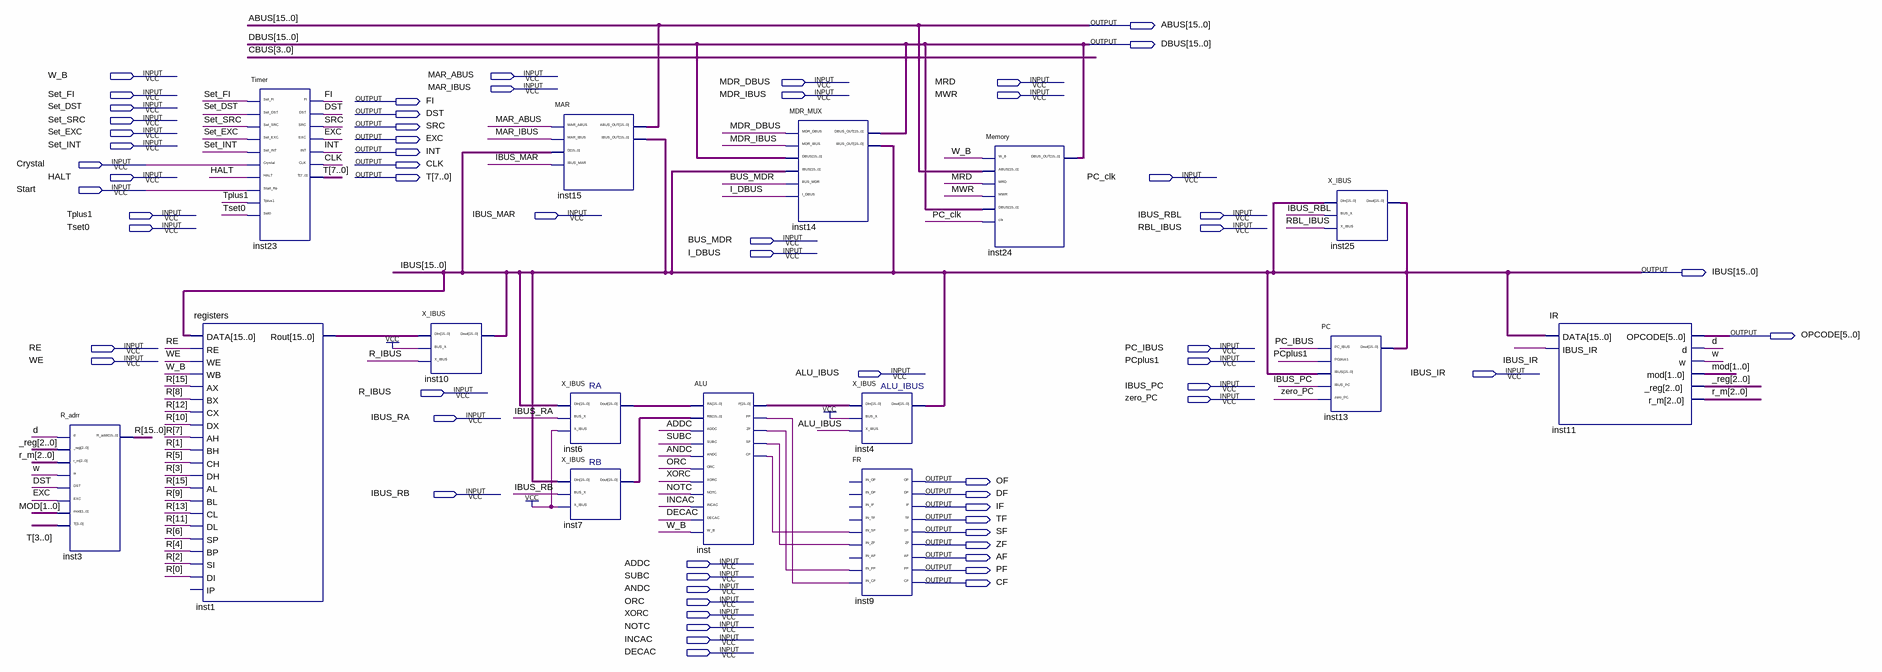
[diagram p0: schematic sheet]
// Quartus schematic CPU_test_withoutCU.bdf as structural Verilog: 15 symbols, 62 pins
module CPU_test_withoutCU (
  input  W_B,
  input  MAR_ABUS,
  input  MDR_DBUS,
  input  MRD,
  input  MAR_IBUS,
  input  Set_FI,
  input  MDR_IBUS,
  input  MWR,
  input  Set_DST,
  input  Set_SRC,
  input  Set_EXC,
  input  Set_INT,
  input  Crystal,
  input  HALT,
  input  PC_clk,
  input  Start,
  input  Tplus1,
  input  IBUS_MAR,
  input  IBUS_RBL,
  input  Tset0,
  input  RBL_IBUS,
  input  BUS_MDR,
  input  I_DBUS,
  input  RE,
  input  PC_IBUS,
  input  WE,
  input  PCplus1,
  input  ALU_IBUS,
  input  IBUS_IR,
  input  IBUS_PC,
  input  R_IBUS,
  input  zero_PC,
  input  IBUS_RA,
  input  IBUS_RB,
  input  ADDC,
  input  SUBC,
  input  ANDC,
  input  ORC,
  input  XORC,
  input  NOTC,
  input  INCAC,
  input  DECAC,
  output [15:0] ABUS,
  output [15:0] DBUS,
  output FI,
  output DST,
  output SRC,
  output EXC,
  output INT,
  output CLK,
  output [7:0] T,
  output [15:0] IBUS,
  output [5:0] OPCODE,
  output OF,
  output DF,
  output IF,
  output TF,
  output SF,
  output ZF,
  output AF,
  output PF,
  output CF
);

  wire d, inst_cf, inst_pf, inst_sf, inst_zf, w;
  wire [1:0] mod;
  wire [2:0] _reg, r_m;
  wire [15:0] inst1_rout, inst6_dout, inst7_dout, inst_f, R;

  R_adrr inst3 (.d(d), ._reg(_reg), .r_m(r_m), .w(w), .DST(DST), .EXC(EXC), .mod(mod), .T(T[3:0]), .R_addr(R));
  registers inst1 (
    .DATA(IBUS), .RE(RE), .WE(WE), .WB(W_B), .AX(R[15]), .BX(R[8]), .CX(R[12]), .DX(R[10]), .AH(R[7]),
    .BH(R[1]), .CH(R[5]), .DH(R[3]), .AL(R[15]), .BL(R[9]), .CL(R[13]), .DL(R[11]), .SP(R[6]), .BP(R[4]),
    .SI(R[2]), .DI(R[0]), .Rout(inst1_rout));  // open: IP
  Timer inst23 (
    .Set_Fi(Set_FI), .Set_DST(Set_DST), .Set_SRC(Set_SRC), .Set_EXC(Set_EXC), .Set_INT(Set_INT),
    .Crystal(Crystal), .HALT(HALT), .Start_Re(Start), .Tplus1(Tplus1), .Set0(Tset0), .FI(FI), .DST(DST),
    .SRC(SRC), .EXC(EXC), .INT(INT), .CLK(CLK), .T(T));
  X_IBUS inst10 (.DIn(inst1_rout), .BUS_X(1'b1), .X_IBUS(R_IBUS), .Dout(IBUS));
  MAR inst15 (
    .MAR_ABUS(MAR_ABUS), .MAR_IBUS(MAR_IBUS), .D(IBUS), .IBUS_MAR(IBUS_MAR), .ABUS_OUT(ABUS), .IBUS_OUT(IBUS));
  X_IBUS inst6 (.DIn(IBUS), .BUS_X(IBUS_RA), .X_IBUS(1'b1), .Dout(inst6_dout));
  X_IBUS inst7 (.DIn(IBUS), .BUS_X(IBUS_RB), .X_IBUS(1'b1), .Dout(inst7_dout));
  ALU inst (
    .RA(inst6_dout), .RB(inst7_dout), .ADDC(ADDC), .SUBC(SUBC), .ANDC(ANDC), .ORC(ORC), .XORC(XORC),
    .NOTC(NOTC), .INCAC(INCAC), .DECAC(DECAC), .W_B(W_B), .F(inst_f), .PF(inst_pf), .ZF(inst_zf),
    .SF(inst_sf), .CF(inst_cf));
  MDR_MUX inst14 (
    .MDR_DBUS(MDR_DBUS), .MDR_IBUS(MDR_IBUS), .DBUS(DBUS), .IBUS(IBUS), .BUS_MDR(BUS_MDR), .I_DBUS(I_DBUS),
    .DBUS_OUT(DBUS), .IBUS_OUT(IBUS));
  X_IBUS inst4 (.DIn(inst_f), .BUS_X(1'b1), .X_IBUS(ALU_IBUS), .Dout(IBUS));
  FR inst9 (
    .IN_SF(inst_cf), .IN_ZF(inst_sf), .IN_PF(inst_zf), .IN_CF(inst_pf), .OF(OF), .DF(DF), .IF(IF), .TF(TF),
    .SF(SF), .ZF(ZF), .AF(AF), .PF(PF), .CF(CF));  // open: IN_OF, IN_DF, IN_IF, IN_TF, IN_AF
  Memory inst24 (.W_B(W_B), .ABUS(ABUS), .MRD(MRD), .MWR(MWR), .DBUS(DBUS), .clk(PC_clk), .DBUS_OUT(DBUS));
  X_IBUS inst25 (.DIn(IBUS), .BUS_X(IBUS_RBL), .X_IBUS(RBL_IBUS), .Dout(IBUS));
  PC inst13 (.PC_IBUS(PC_IBUS), .PCplus1(PCplus1), .IBUS(IBUS), .IBUS_PC(IBUS_PC), .zero_PC(zero_PC), .Dout(IBUS));
  IR inst11 (.DATA(IBUS), .IBUS_IR(IBUS_IR), .OPCODE(OPCODE), .d(d), .w(w), .mod(mod), ._reg(_reg), .r_m(r_m));
endmodule
